# Altium schematic sheet 野火_EBF6ULL B1 核心板_原理图封装参考设计_AD格式.SchDoc
size 431 x 279 mm
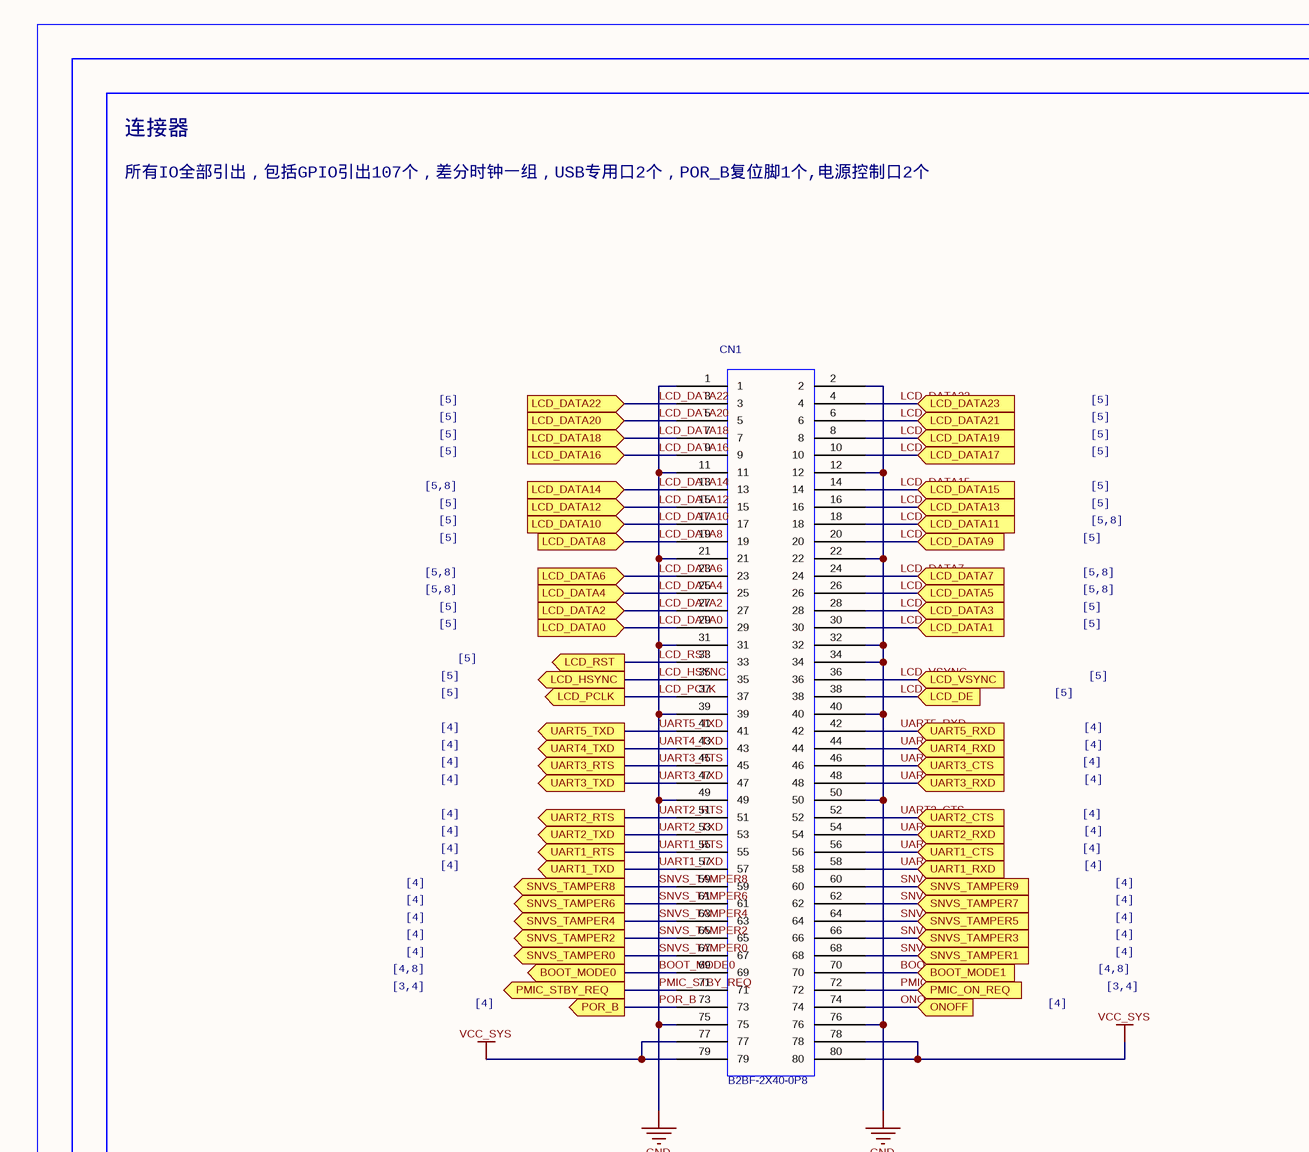
[diagram p0: 野火_EBF6ULL B1 核心板_原理图封装参考设计_AD格式.SchDoc, top left]
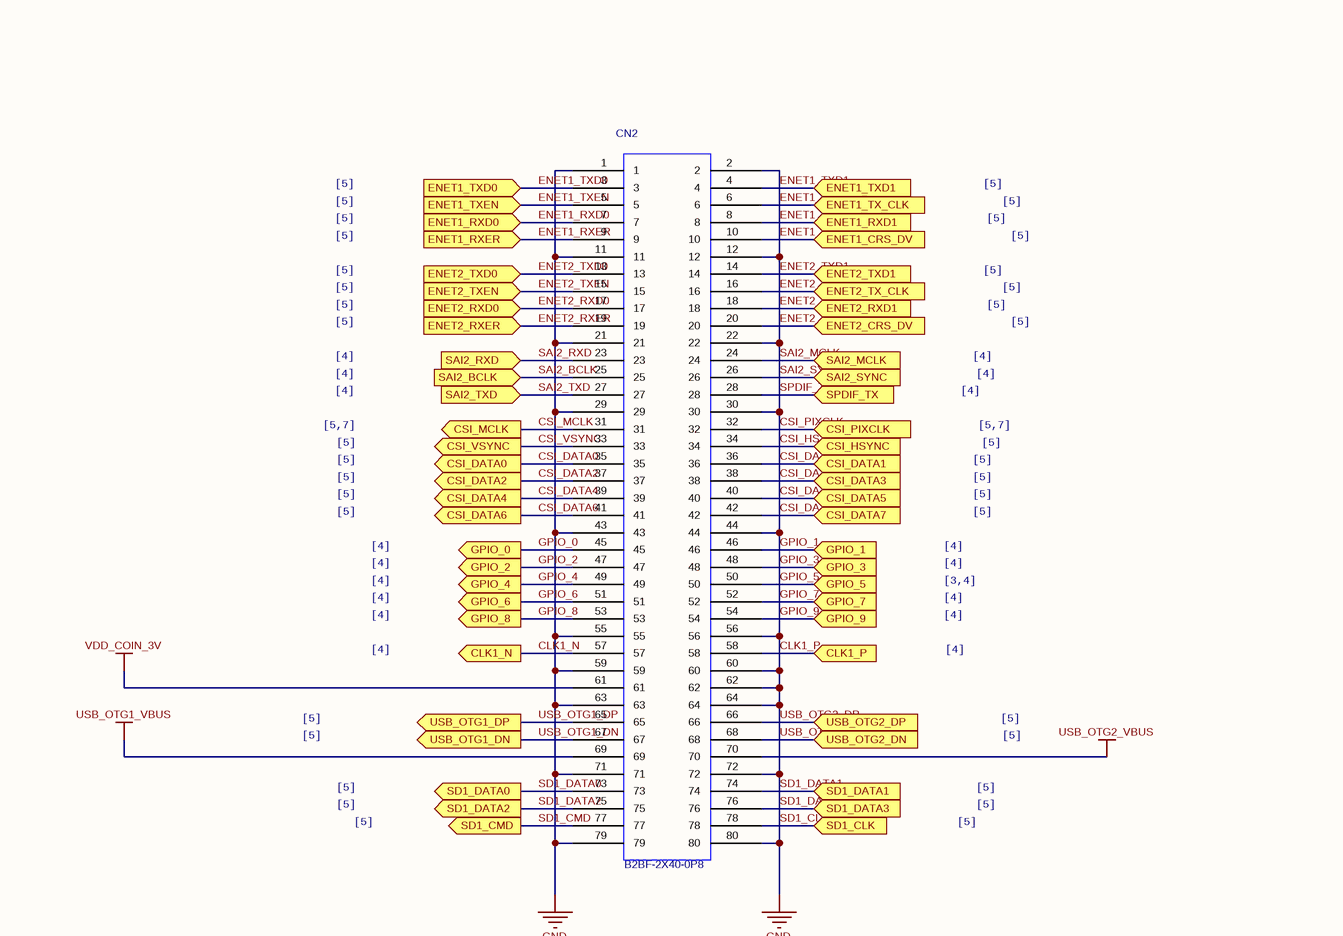
[diagram p1: 野火_EBF6ULL B1 核心板_原理图封装参考设计_AD格式.SchDoc, top right]
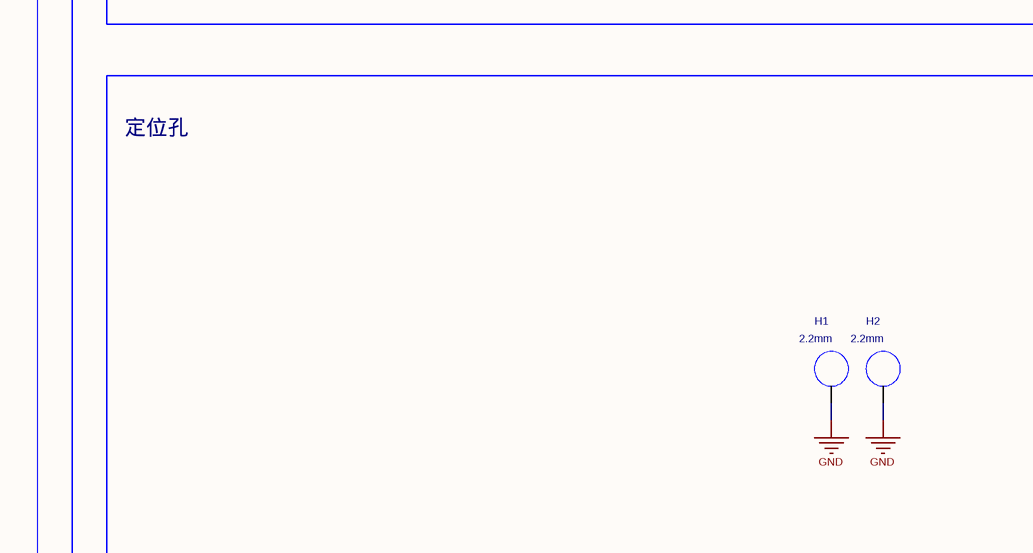
[diagram p2: 野火_EBF6ULL B1 核心板_原理图封装参考设计_AD格式.SchDoc, bottom left]
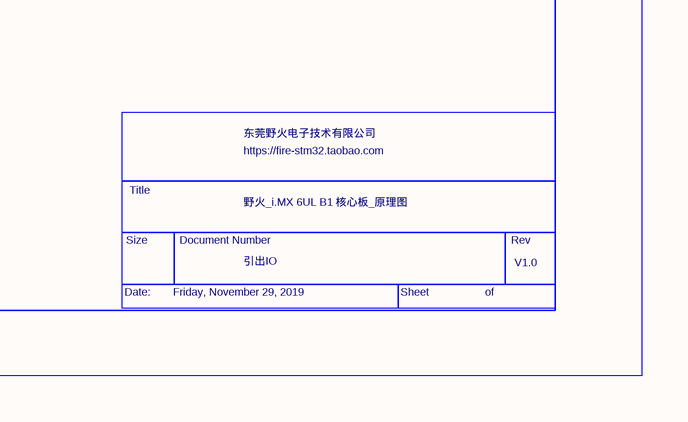
[diagram p3: 野火_EBF6ULL B1 核心板_原理图封装参考设计_AD格式.SchDoc, bottom right]

## Parts
CN1  value B2BF-2X40-0P8  [B2BF-2X40-0P8]  (hidden comment: B2BF_2X40_A)
CN2  value B2BF-2X40-0P8  [B2BF-2X40-0P8]  (hidden comment: B2BF_2X40_A)
H1  value 2.2mm  [T2_5-4]  (hidden comment: SPACER_0)
H2  value 2.2mm  [T2_5-4]  (hidden comment: SPACER_0)

## Blocks framed on the sheet
连接器: CN1 CN2
定位孔: H1 H2

## Ports
BOOT_MODE0 (out), BOOT_MODE1, CLK1_N (out), CLK1_P, CSI_DATA0 (out), CSI_DATA1, CSI_DATA2 (out), CSI_DATA3, CSI_DATA4 (out), CSI_DATA5, CSI_DATA6 (out), CSI_DATA7, CSI_HSYNC, CSI_MCLK (out), CSI_PIXCLK, CSI_VSYNC (out), ENET1_CRS_DV, ENET1_RXD0, ENET1_RXD1, ENET1_RXER, ENET1_TX_CLK, ENET1_TXD0, ENET1_TXD1, ENET1_TXEN, ENET2_CRS_DV, ENET2_RXD0, ENET2_RXD1, ENET2_RXER, ENET2_TX_CLK, ENET2_TXD0, ENET2_TXD1, ENET2_TXEN, GPIO_0 (out), GPIO_1, GPIO_2 (out), GPIO_3, GPIO_4 (out), GPIO_5, GPIO_6 (out), GPIO_7, GPIO_8 (out), GPIO_9, LCD_DATA0, LCD_DATA1, LCD_DATA2, LCD_DATA3, LCD_DATA4, LCD_DATA5, LCD_DATA6, LCD_DATA7, LCD_DATA8, LCD_DATA9, LCD_DATA10, LCD_DATA11, LCD_DATA12, LCD_DATA13, LCD_DATA14, LCD_DATA15, LCD_DATA16, LCD_DATA17, LCD_DATA18, LCD_DATA19, LCD_DATA20, LCD_DATA21, LCD_DATA22, LCD_DATA23, LCD_DE, LCD_HSYNC (out), LCD_PCLK (out), LCD_RST (out), LCD_VSYNC, ONOFF, PMIC_ON_REQ, PMIC_STBY_REQ (out), POR_B (out), SAI2_BCLK, SAI2_MCLK, SAI2_RXD, SAI2_SYNC, SAI2_TXD, SD1_CLK, SD1_CMD (out), SD1_DATA0 (out), SD1_DATA1, SD1_DATA2 (out), SD1_DATA3, SNVS_TAMPER0 (out), SNVS_TAMPER1, SNVS_TAMPER2 (out), SNVS_TAMPER3, SNVS_TAMPER4 (out), SNVS_TAMPER5, SNVS_TAMPER6 (out), SNVS_TAMPER7, SNVS_TAMPER8 (out), SNVS_TAMPER9, SPDIF_TX, UART1_CTS, UART1_RTS (out), UART1_RXD, UART1_TXD (out), UART2_CTS, UART2_RTS (out), UART2_RXD, UART2_TXD (out), UART3_CTS, UART3_RTS (out), UART3_RXD, UART3_TXD (out), UART4_RXD, UART4_TXD (out), UART5_RXD, UART5_TXD (out), USB_OTG1_DN (out), USB_OTG1_DP (out), USB_OTG2_DN, USB_OTG2_DP

## Nets
BOOT_MODE0: CN1.1 CN1.2 CN1.3 CN1.5 CN1.7 CN1.9 CN1.11 CN1.12 CN1.13 CN1.15 CN1.17 CN1.19 CN1.21 CN1.22 CN1.23 CN1.25 CN1.27 CN1.29 CN1.31 CN1.32 CN1.33 CN1.34 CN1.35 CN1.37 CN1.39 CN1.40 CN1.41 CN1.43 CN1.45 CN1.47 CN1.49 CN1.50 CN1.51 CN1.53 CN1.55 CN1.57 CN1.59 CN1.61 CN1.63 CN1.65 CN1.67 CN1.69 CN1.71 CN1.73 CN1.75 CN1.76 CN2.1 CN2.2 CN2.4 CN2.6 CN2.8 CN2.10 CN2.11 CN2.12 CN2.14 CN2.16 CN2.18 CN2.20 CN2.21 CN2.22 CN2.24 CN2.26 CN2.28 CN2.29 CN2.30 CN2.32 CN2.34 CN2.36 CN2.38 CN2.40 CN2.42 CN2.43 CN2.44 CN2.46 CN2.48 CN2.50 CN2.52 CN2.54 CN2.55 CN2.56 CN2.58 CN2.59 CN2.60 CN2.62 CN2.63 CN2.64 CN2.66 CN2.68 CN2.71 CN2.72 CN2.74 CN2.76 CN2.78 CN2.79 CN2.80 H1.1(NC_1) H2.1(NC_1) ; port LCD_DATA18, port LCD_DATA16, port LCD_DATA14, port UART1_RTS, port UART2_TXD, port UART1_TXD, port PMIC_STBY_REQ, port LCD_PCLK, port UART5_TXD, port UART4_TXD, port UART3_RTS, port UART3_TXD, port UART2_RTS, port LCD_DATA12, port LCD_DATA10, port LCD_DATA8, port LCD_DATA6, port LCD_DATA4, port LCD_DATA2, port LCD_DATA0, port POR_B, port LCD_HSYNC, port LCD_DATA20, port LCD_DATA22, port ENET1_TXD1, port ENET1_TX_CLK, port ENET1_RXD1, port ENET1_CRS_DV, port CLK1_P, port GPIO_7, port GPIO_9, port USB_OTG2_DP, port USB_OTG2_DN, port SD1_DATA1, port CSI_DATA3, port CSI_DATA7, port GPIO_1, port GPIO_3, port SAI2_MCLK, port CSI_PIXCLK, port SAI2_SYNC, port SPDIF_TX, port CSI_DATA1, port SD1_DATA3, port SD1_CLK, port ENET2_TXD1, port ENET2_TX_CLK, port ENET2_RXD1, port ENET2_CRS_DV, port CSI_HSYNC, port CSI_DATA5, port GPIO_5, port SNVS_TAMPER8, port SNVS_TAMPER6, port SNVS_TAMPER4, port SNVS_TAMPER2, port SNVS_TAMPER0, port BOOT_MODE0, port LCD_RST  [also labelled CLK1_P, CSI_DATA1, CSI_DATA3, CSI_DATA5, CSI_DATA7, CSI_HSYNC, CSI_PIXCLK, ENET1_CRS_DV, ENET1_RXD1, ENET1_TX_CLK, ENET1_TXD1, ENET2_CRS_DV, ENET2_RXD1, ENET2_TX_CLK, ENET2_TXD1, GND, GPIO_1, GPIO_3, GPIO_5, GPIO_7, GPIO_9, LCD_DATA0, LCD_DATA10, LCD_DATA12, LCD_DATA14, LCD_DATA16, LCD_DATA18, LCD_DATA2, LCD_DATA20, LCD_DATA22, LCD_DATA4, LCD_DATA6, LCD_DATA8, LCD_HSYNC, LCD_PCLK, LCD_RST, PMIC_STBY_REQ, POR_B, SAI2_MCLK, SAI2_SYNC, SD1_CLK, SD1_DATA1, SD1_DATA3, SNVS_TAMPER0, SNVS_TAMPER2, SNVS_TAMPER4, SNVS_TAMPER6, SNVS_TAMPER8, SPDIF_TX, UART1_RTS, UART1_TXD, UART2_RTS, UART2_TXD, UART3_RTS, UART3_TXD, UART4_TXD, UART5_TXD, USB_OTG2_DN, USB_OTG2_DP]
USB_OTG1_VBUS: CN2.69
USB_OTG2_VBUS: CN2.70
VCC_SYS: CN1.77 CN1.78 CN1.79 CN1.80
VDD_COIN_3V: CN2.61
BOOT_MODE1: CN1.70 ; port BOOT_MODE1
CLK1_N: CN2.57 ; port CLK1_N
CSI_DATA0: CN2.35 ; port CSI_DATA0
CSI_DATA2: CN2.37 ; port CSI_DATA2
CSI_DATA4: CN2.39 ; port CSI_DATA4
CSI_DATA6: CN2.41 ; port CSI_DATA6
CSI_MCLK: CN2.31 ; port CSI_MCLK
CSI_VSYNC: CN2.33 ; port CSI_VSYNC
ENET1_RXD0: CN2.7 ; port ENET1_RXD0
ENET1_RXER: CN2.9 ; port ENET1_RXER
ENET1_TXD0: CN2.3 ; port ENET1_TXD0
ENET1_TXEN: CN2.5 ; port ENET1_TXEN
ENET2_RXD0: CN2.17 ; port ENET2_RXD0
ENET2_RXER: CN2.19 ; port ENET2_RXER
ENET2_TXD0: CN2.13 ; port ENET2_TXD0
ENET2_TXEN: CN2.15 ; port ENET2_TXEN
GPIO_0: CN2.45 ; port GPIO_0
GPIO_2: CN2.47 ; port GPIO_2
GPIO_4: CN2.49 ; port GPIO_4
GPIO_6: CN2.51 ; port GPIO_6
GPIO_8: CN2.53 ; port GPIO_8
LCD_DATA1: CN1.30 ; port LCD_DATA1
LCD_DATA3: CN1.28 ; port LCD_DATA3
LCD_DATA5: CN1.26 ; port LCD_DATA5
LCD_DATA7: CN1.24 ; port LCD_DATA7
LCD_DATA9: CN1.20 ; port LCD_DATA9
LCD_DATA11: CN1.18 ; port LCD_DATA11
LCD_DATA13: CN1.16 ; port LCD_DATA13
LCD_DATA15: CN1.14 ; port LCD_DATA15
LCD_DATA17: CN1.10 ; port LCD_DATA17
LCD_DATA19: CN1.8 ; port LCD_DATA19
LCD_DATA21: CN1.6 ; port LCD_DATA21
LCD_DATA23: CN1.4 ; port LCD_DATA23
LCD_DE: CN1.38 ; port LCD_DE
LCD_VSYNC: CN1.36 ; port LCD_VSYNC
ONOFF: CN1.74 ; port ONOFF
PMIC_ON_REQ: CN1.72 ; port PMIC_ON_REQ
SAI2_BCLK: CN2.25 ; port SAI2_BCLK
SAI2_RXD: CN2.23 ; port SAI2_RXD
SAI2_TXD: CN2.27 ; port SAI2_TXD
SD1_CMD: CN2.77 ; port SD1_CMD
SD1_DATA0: CN2.73 ; port SD1_DATA0
SD1_DATA2: CN2.75 ; port SD1_DATA2
SNVS_TAMPER1: CN1.68 ; port SNVS_TAMPER1
SNVS_TAMPER3: CN1.66 ; port SNVS_TAMPER3
SNVS_TAMPER5: CN1.64 ; port SNVS_TAMPER5
SNVS_TAMPER7: CN1.62 ; port SNVS_TAMPER7
SNVS_TAMPER9: CN1.60 ; port SNVS_TAMPER9
UART1_CTS: CN1.56 ; port UART1_CTS
UART1_RXD: CN1.58 ; port UART1_RXD
UART2_CTS: CN1.52 ; port UART2_CTS
UART2_RXD: CN1.54 ; port UART2_RXD
UART3_CTS: CN1.46 ; port UART3_CTS
UART3_RXD: CN1.48 ; port UART3_RXD
UART4_RXD: CN1.44 ; port UART4_RXD
UART5_RXD: CN1.42 ; port UART5_RXD
USB_OTG1_DN: CN2.67 ; port USB_OTG1_DN
USB_OTG1_DP: CN2.65 ; port USB_OTG1_DP

## Notes on the sheet
- 所有IO全部引出，包括GPIO引出107个，差分时钟一组，USB专用口2个，POR_B复位脚1个,电源控制口2个
- [5]
- [5,8]
- [5,7]
- [4]
- [3,4]
- [4,8]
- https://fire-stm32.taobao.com
- 东莞野火电子技术有限公司
- Title
- 野火_i.MX 6UL B1 核心板_原理图
- Date:
- Size
- Friday, November 29, 2019
- Document Number
- 引出IO
- Sheet
- of
- Rev
- V1.0

## Library data of the parts
CN1 CN2 = B2BF_2X40_A: Source_Path: C:\MYPROGRAM\CADENCE\SPB_16.6\TOOLS\CAPTURE\LIBRARY\CONNECTOR.OLB; PCB DECAL: B2BF-2X40-0P8
H1 H2 = SPACER_0: FASTENER, STANDOFF 4.5MMX3.53XM3.0X0.5 ROUND THR .635"L BRASS; AGILE_PN: 280-76498; MFG_NAME01: UNICORP; MFG_PN01: MSS251-R-1-A-16; ASSY_OPT: DNP; CAD_APPROVED: Yes; Source_Path: H:\NXP_RT1050\SCH\IMXRT1052.DSN; CLASS: IC; ROHS: Yes; HEIGHT: 16.13MM; PCB DECAL: T2_5-4